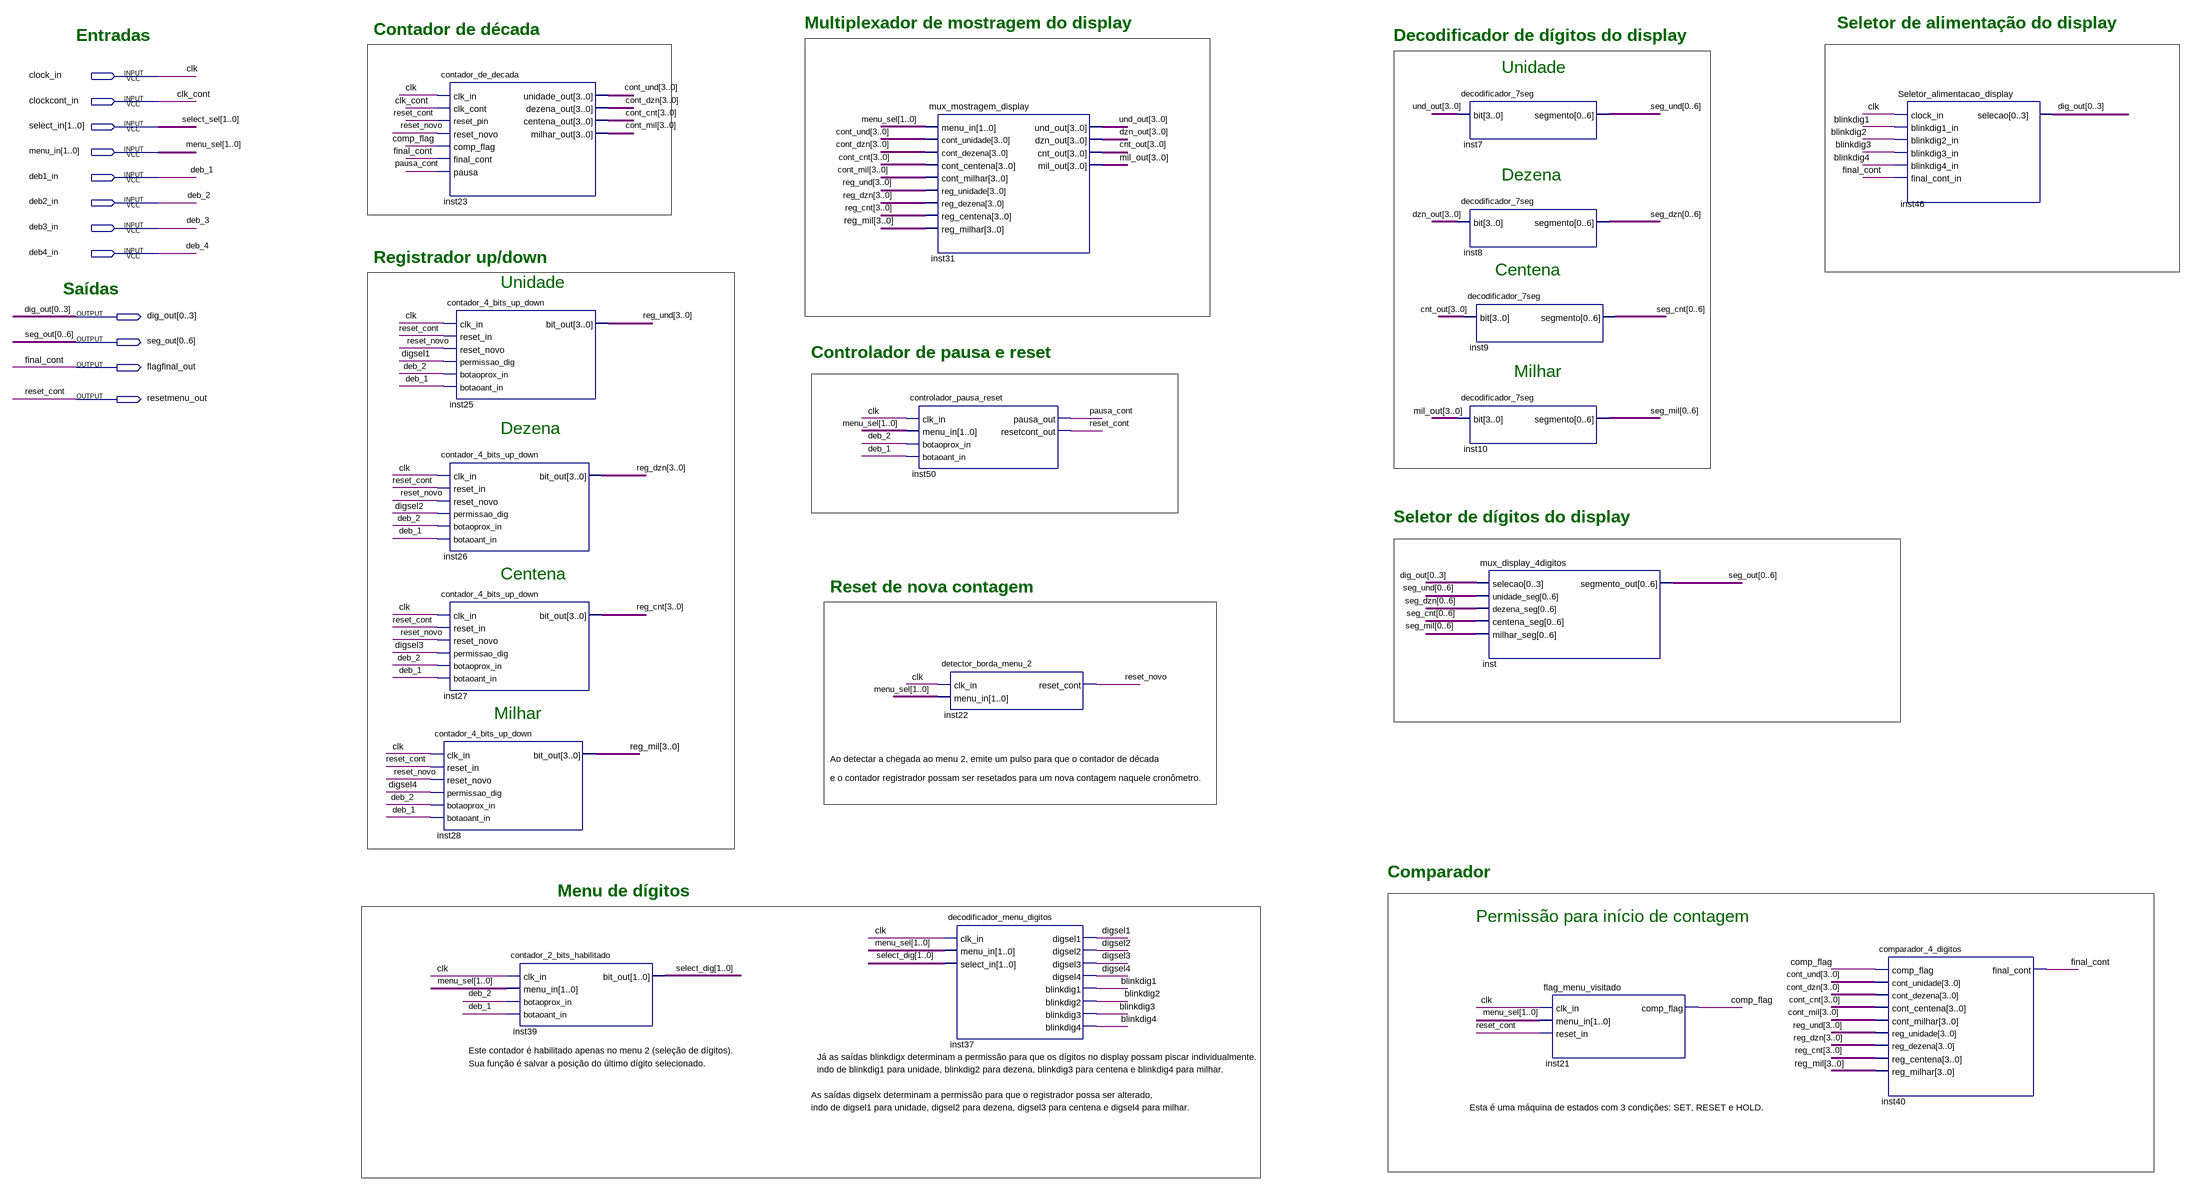
[diagram p0: schematic sheet]
// Quartus schematic Cronometro.bdf as structural Verilog: 18 symbols, 12 pins
module Cronometro (
  input  clock_in,
  input  clockcont_in,
  input  [1:0] select_in,
  input  [1:0] menu_in,
  input  deb1_in,
  input  deb2_in,
  input  deb3_in,
  input  deb4_in,
  output [0:3] dig_out,
  output [0:6] seg_out,
  output flagfinal_out,
  output resetmenu_out
);

  wire blinkdig1, blinkdig2, blinkdig3, blinkdig4, comp_flag, digsel1, digsel2, digsel3, digsel4, pausa_cont,
       reset_novo;
  wire [1:0] select_dig;
  wire [3:0] cnt_out, cont_cnt, cont_dzn, cont_mil, cont_und, dzn_out, mil_out, reg_cnt, reg_dzn, reg_mil,
       reg_und, und_out;
  wire [6:0] seg_cnt, seg_dzn, seg_mil, seg_und;

  contador_de_decada inst23 (
    .clk_in(clock_in), .clk_cont(clockcont_in), .reset_pin(resetmenu_out), .reset_novo(reset_novo),
    .comp_flag(comp_flag), .final_cont(flagfinal_out), .pausa(pausa_cont), .unidade_out(cont_und),
    .dezena_out(cont_dzn), .centena_out(cont_cnt), .milhar_out(cont_mil));
  contador_4_bits_up_down inst25 (
    .clk_in(clock_in), .reset_in(resetmenu_out), .reset_novo(reset_novo), .permissao_dig(digsel1),
    .botaoprox_in(deb2_in), .botaoant_in(deb1_in), .bit_out(reg_und));
  contador_4_bits_up_down inst26 (
    .clk_in(clock_in), .reset_in(resetmenu_out), .reset_novo(reset_novo), .permissao_dig(digsel2),
    .botaoprox_in(deb2_in), .botaoant_in(deb1_in), .bit_out(reg_dzn));
  contador_4_bits_up_down inst27 (
    .clk_in(clock_in), .reset_in(resetmenu_out), .reset_novo(reset_novo), .permissao_dig(digsel3),
    .botaoprox_in(deb2_in), .botaoant_in(deb1_in), .bit_out(reg_cnt));
  contador_4_bits_up_down inst28 (
    .clk_in(clock_in), .reset_in(resetmenu_out), .reset_novo(reset_novo), .permissao_dig(digsel4),
    .botaoprox_in(deb2_in), .botaoant_in(deb1_in), .bit_out(reg_mil));
  contador_2_bits_habilitado inst39 (
    .clk_in(clock_in), .menu_in(menu_in), .botaoprox_in(deb2_in), .botaoant_in(deb1_in), .bit_out(select_dig));
  mux_mostragem_display inst31 (
    .menu_in(menu_in), .cont_unidade(cont_und), .cont_dezena(cont_dzn), .cont_centena(cont_cnt),
    .cont_milhar(cont_mil), .reg_unidade(reg_und), .reg_dezena(reg_dzn), .reg_centena(reg_cnt),
    .reg_milhar(reg_mil), .und_out(und_out), .dzn_out(dzn_out), .cnt_out(cnt_out), .mil_out(mil_out));
  controlador_pausa_reset inst50 (
    .clk_in(clock_in), .menu_in(menu_in), .botaoprox_in(deb2_in), .botaoant_in(deb1_in),
    .pausa_out(pausa_cont), .resetcont_out(resetmenu_out));
  detector_borda_menu_2 inst22 (.clk_in(clock_in), .menu_in(menu_in), .reset_cont(reset_novo));
  decodificador_menu_digitos inst37 (
    .clk_in(clock_in), .menu_in(menu_in), .select_in(select_dig), .digsel1(digsel1), .digsel2(digsel2),
    .digsel3(digsel3), .digsel4(digsel4), .blinkdig1(blinkdig1), .blinkdig2(blinkdig2),
    .blinkdig3(blinkdig3), .blinkdig4(blinkdig4));
  decodificador_7seg inst7 (
    .\bit (und_out),
    .segmento({seg_und[0], seg_und[1], seg_und[2], seg_und[3], seg_und[4], seg_und[5], seg_und[6]}));
  decodificador_7seg inst8 (
    .\bit (dzn_out),
    .segmento({seg_dzn[0], seg_dzn[1], seg_dzn[2], seg_dzn[3], seg_dzn[4], seg_dzn[5], seg_dzn[6]}));
  decodificador_7seg inst10 (
    .\bit (mil_out),
    .segmento({seg_mil[0], seg_mil[1], seg_mil[2], seg_mil[3], seg_mil[4], seg_mil[5], seg_mil[6]}));
  decodificador_7seg inst9 (
    .\bit (cnt_out),
    .segmento({seg_cnt[0], seg_cnt[1], seg_cnt[2], seg_cnt[3], seg_cnt[4], seg_cnt[5], seg_cnt[6]}));
  mux_display_4digitos inst (
    .selecao(dig_out),
    .unidade_seg({seg_und[0], seg_und[1], seg_und[2], seg_und[3], seg_und[4], seg_und[5], seg_und[6]}),
    .dezena_seg({seg_dzn[0], seg_dzn[1], seg_dzn[2], seg_dzn[3], seg_dzn[4], seg_dzn[5], seg_dzn[6]}),
    .centena_seg({seg_cnt[0], seg_cnt[1], seg_cnt[2], seg_cnt[3], seg_cnt[4], seg_cnt[5], seg_cnt[6]}),
    .milhar_seg({seg_mil[0], seg_mil[1], seg_mil[2], seg_mil[3], seg_mil[4], seg_mil[5], seg_mil[6]}),
    .segmento_out(seg_out));
  flag_menu_visitado inst21 (.clk_in(clock_in), .menu_in(menu_in), .reset_in(resetmenu_out), .comp_flag(comp_flag));
  Seletor_alimentacao_display inst46 (
    .clock_in(clock_in), .blinkdig1_in(blinkdig1), .blinkdig2_in(blinkdig2), .blinkdig3_in(blinkdig3),
    .blinkdig4_in(blinkdig4), .final_cont_in(flagfinal_out), .selecao(dig_out));
  comparador_4_digitos inst40 (
    .comp_flag(comp_flag), .cont_unidade(cont_und), .cont_dezena(cont_dzn), .cont_centena(cont_cnt),
    .cont_milhar(cont_mil), .reg_unidade(reg_und), .reg_dezena(reg_dzn), .reg_centena(reg_cnt),
    .reg_milhar(reg_mil), .final_cont(flagfinal_out));

  // Other names for the same wires on the sheet: clk = clock_in; clk_cont = clockcont_in; deb_1 = deb1_in;
  //   deb_2 = deb2_in; deb_3 = deb3_in; deb_4 = deb4_in; final_cont = flagfinal_out; menu_sel[1:0] = menu_in;
  //   reset_cont = resetmenu_out; select_sel[1:0] = select_in

  // Notes on the sheet:
  //   Multiplexador de mostragem do display
  //   Seletor de alimentação do display
  //   Contador de década
  //   Entradas
  //   Decodificador de dígitos do display
  //   Unidade
  //   Dezena
  //   Registrador up/down
  //   Centena
  //   Unidade
  //   Saídas
  //   Controlador de pausa e reset
  //   Milhar
  //   Dezena
  //   Seletor de dígitos do display
  //   Centena
  //   Reset de nova contagem
  //   Milhar
  //   Ao detectar a chegada ao menu 2, emite um pulso para que o contador de década
  //   e o contador registrador possam ser resetados para um nova contagem naquele cronômetro.
  //   Comparador
  //   Menu de dígitos
  //   Permissão para início de contagem
  //   Este contador é habilitado apenas no menu 2 (seleção de dígitos).
  //   Já as saídas blinkdigx determinam a permissão para que os dígitos no display possam piscar individualmente.
  //   Sua função é salvar a posição do último dígito selecionado.
  //   indo de blinkdig1 para unidade, blinkdig2 para dezena, blinkdig3 para centena e blinkdig4 para milhar.
  //   As saídas digselx determinam a permissão para que o registrador possa ser alterado,
  //   indo de digsel1 para unidade, digsel2 para dezena, digsel3 para centena e digsel4 para milhar.
  //   Esta é uma máquina de estados com 3 condições: SET, RESET e HOLD.
endmodule
